# Altium project TP2_ESP8266.PrjPcb
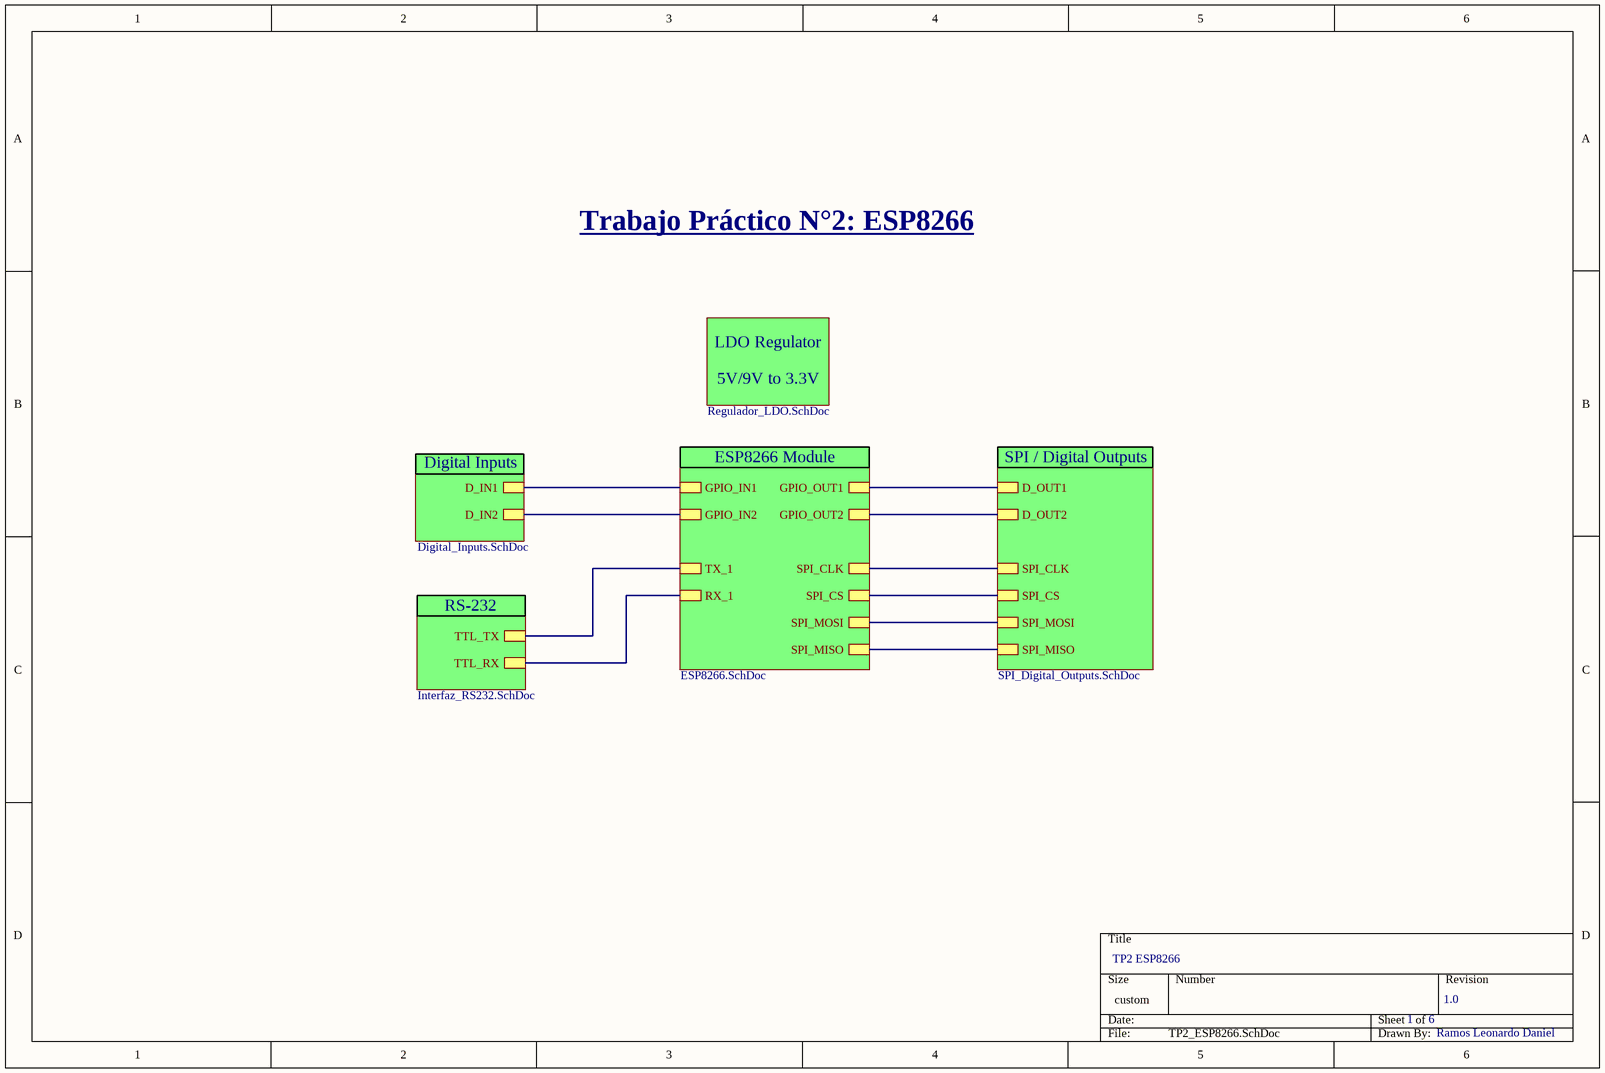
[diagram p0: TP2_ESP8266.SchDoc]
6 sheets, 33 parts. Net scope: hierarchical (ports join the sheet entries above them; power ports are global).
Board file: TP2_ESP8266.PcbDoc
Sheets:
  TP2_ESP8266.SchDoc
    Regulador LDO = Regulador_LDO.SchDoc
    RS-232 = Interfaz_RS232.SchDoc
    Digital Inputs = Digital_Inputs.SchDoc
    SPI/ Digital_Outputs = SPI_Digital_Outputs.SchDoc
    ESP8266 = ESP8266.SchDoc

## Sheet TP2_ESP8266.SchDoc: Leonardo
size 300 x 200 mm; SheetNumber: 1; SheetTotal: 6

### Sub-sheets
Digital Inputs = Digital_Inputs.SchDoc: D_IN1, D_IN2
ESP8266 = ESP8266.SchDoc: TX_1, RX_1, SPI_CLK, SPI_CS, SPI_MISO, SPI_MOSI, GPIO_IN1, GPIO_IN2, GPIO_OUT1, GPIO_OUT2
Regulador LDO = Regulador_LDO.SchDoc: no entries
RS-232 = Interfaz_RS232.SchDoc: TTL_TX, TTL_RX
SPI/ Digital_Outputs = SPI_Digital_Outputs.SchDoc: D_OUT1, D_OUT2, SPI_CLK, SPI_CS, SPI_MOSI, SPI_MISO

### Nets
DIGITAL_IN1: sheet Digital Inputs/D_IN1, sheet ESP8266/GPIO_IN1
DIGITAL_IN2: sheet Digital Inputs/D_IN2, sheet ESP8266/GPIO_IN2
DIGITAL_OUT1: sheet SPI/ Digital_Outputs/D_OUT1, sheet ESP8266/GPIO_OUT1
DIGITAL_OUT2: sheet SPI/ Digital_Outputs/D_OUT2, sheet ESP8266/GPIO_OUT2
RX_1: sheet RS-232/TTL_RX, sheet ESP8266/RX_1
SPI_CLK: sheet SPI/ Digital_Outputs/SPI_CLK, sheet ESP8266/SPI_CLK
SPI_CS: sheet SPI/ Digital_Outputs/SPI_CS, sheet ESP8266/SPI_CS
SPI_MISO: sheet SPI/ Digital_Outputs/SPI_MISO, sheet ESP8266/SPI_MISO
SPI_MOSI: sheet SPI/ Digital_Outputs/SPI_MOSI, sheet ESP8266/SPI_MOSI
TX_1: sheet RS-232/TTL_TX, sheet ESP8266/TX_1

### Notes on the sheet
- Trabajo Práctico N°2: ESP8266
- LDO Regulator
- 5V/9V to 3.3V
- Digital Inputs
- ESP8266 Module
- SPI / Digital Outputs
- RS-232
- TP2 ESP8266
- 1
- 6
- 1.0
- Ramos Leonardo Daniel

## Sheet Regulador_LDO.SchDoc
size A4; SheetNumber: 2; SheetTotal: 6
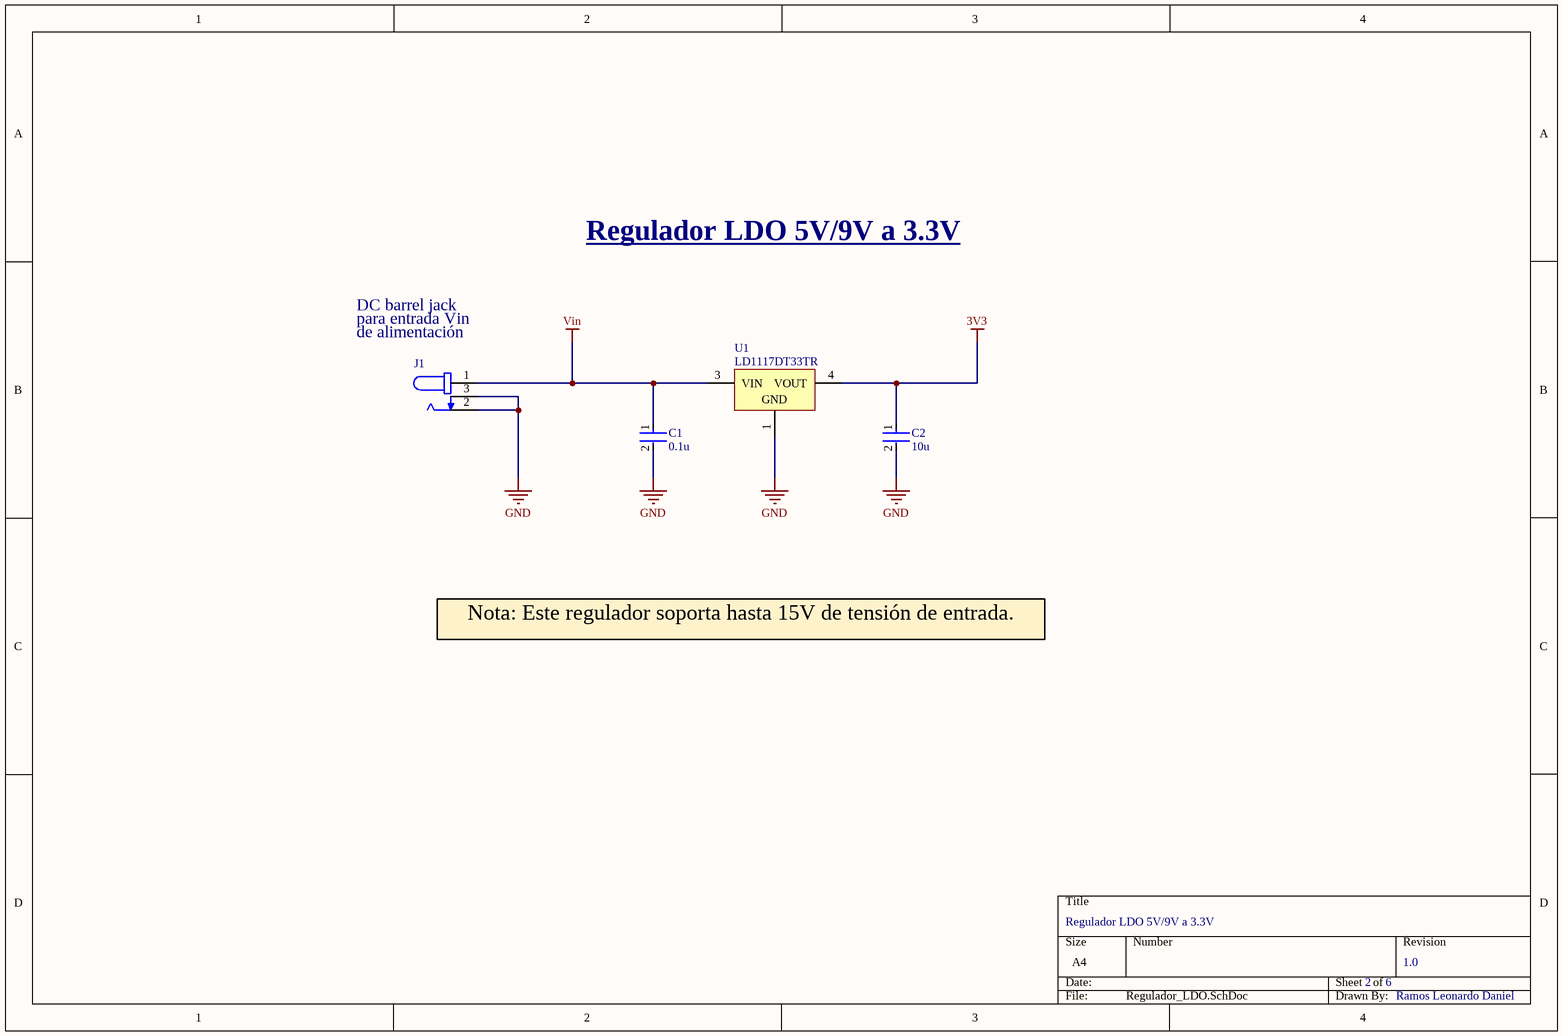
[diagram p1: Regulador_LDO.SchDoc]

### Parts
C1  0.1u  [FP-GRM21B-0_1-IPC_B]
C2  10u  [FP-C0805C106J8RACAUTO-MFG]
J1  DCJ200-10-A-XX-K_REVA  [GCT_DCJ200-10-A-XX-K_REVA]  (value not drawn)
U1  LD1117DT33TR  [TO-252_N]

### Nets
3V3: C2.1 U1.4(VOUT)
GND: C1.2 C2.2 J1.2 J1.3 U1.1(GND)
Vin: C1.1 J1.1 U1.3(VIN)

### Notes on the sheet
- Regulador LDO 5V/9V a 3.3V
- DC barrel jack
- para entrada Vin
- (near J1) de alimentación
- Nota: Este regulador soporta hasta 15V de tensión de entrada.
- 2
- 6
- 1.0
- Ramos Leonardo Daniel

### Library data of the parts
C1 = CMP-06035-037063-1: Chip Multilayer Ceramic Capacitors for General Purpose, 0805, 0.10uF, U2J, -750ppm/°C, 5%, 10V; Capacitance: 100nF; Depth: 1.25mm; Voltage Rating (DC): 10V; Voltage Rating: 10V; Length: 2mm; Max Operating Temperature: 125°C; Thickness: 0.053inch; Dielectric: U2J; Termination: SMD/SMT; Package Quantity: 3000; Packaging: Tape and Reel; Case Code (Metric): 2012; Tolerance: 5%; Case Code (Imperial): 0805; Case/Package: 0805; Mount: Surface Mount; Width: 0.049inch; Height: 1.25mm; Radiation Hardening: No; Min Operating Temperature: -55°C
C2 = CMP-03020-034708-1: CAP CER 10UF 10V X7R 0805; Tolerance: 5%; Mount: Surface Mount; Capacitance: 10uF; Voltage Rating: 10V; Max Operating Temperature: 125°C; Min Operating Temperature: -55°C; Case/Package: 0805; RoHS Compliant: Yes; Packaging: Tape and Reel; Case Code (Imperial): 0805; Case Code (Metric): 2012; Ratings: AEC-Q200
J1 = DCJ200-10-A-XX-K_REVA: Power Barrel Connector Jack 2.05mm ID (0.081), 5.50mm OD (0.217) Through Hole, Right Angle; MF: Global Connector Technology; MP: DCJ200-10-A-K1-K; SnapEDA_Link: https://www.snapeda.com/parts/DCJ200-10-A-K1-K/Global+Connector+Technology/view-part/?ref=snap; Package: None; Value: *; Check_prices: https://www.snapeda.com/parts/DCJ200-10-A-K1-K/Global+Connector+Technology/view-part/?ref=eda
U1 = CMP-0244-00088-1: Fixed Low Drop Positive Voltage Regulator, 3.3V, 3-Pin DPAK, Tape and Reel; ComponentLink1Description: Manufacturer URL; PackageVersion: 2011; PackageReference: TO-252; ComponentLink2Description: Datasheet; ComponentLink1URL: http://www.st.com; DatasheetVersion: 1/11/2011; PackageDescription: 3-Pin Transistor Outline Package 2.28 mm Pitch, 9.7 mm Lead Span (DPAK); ComponentLink2URL: http://www.st.com/internet/com/TECHNICAL_RESOURCES/TECHNICAL_LITERATURE/DATASHEET/CD00000544.pdf

## Sheet Interfaz_RS232.SchDoc
size A4; SheetNumber: 3; SheetTotal: 6
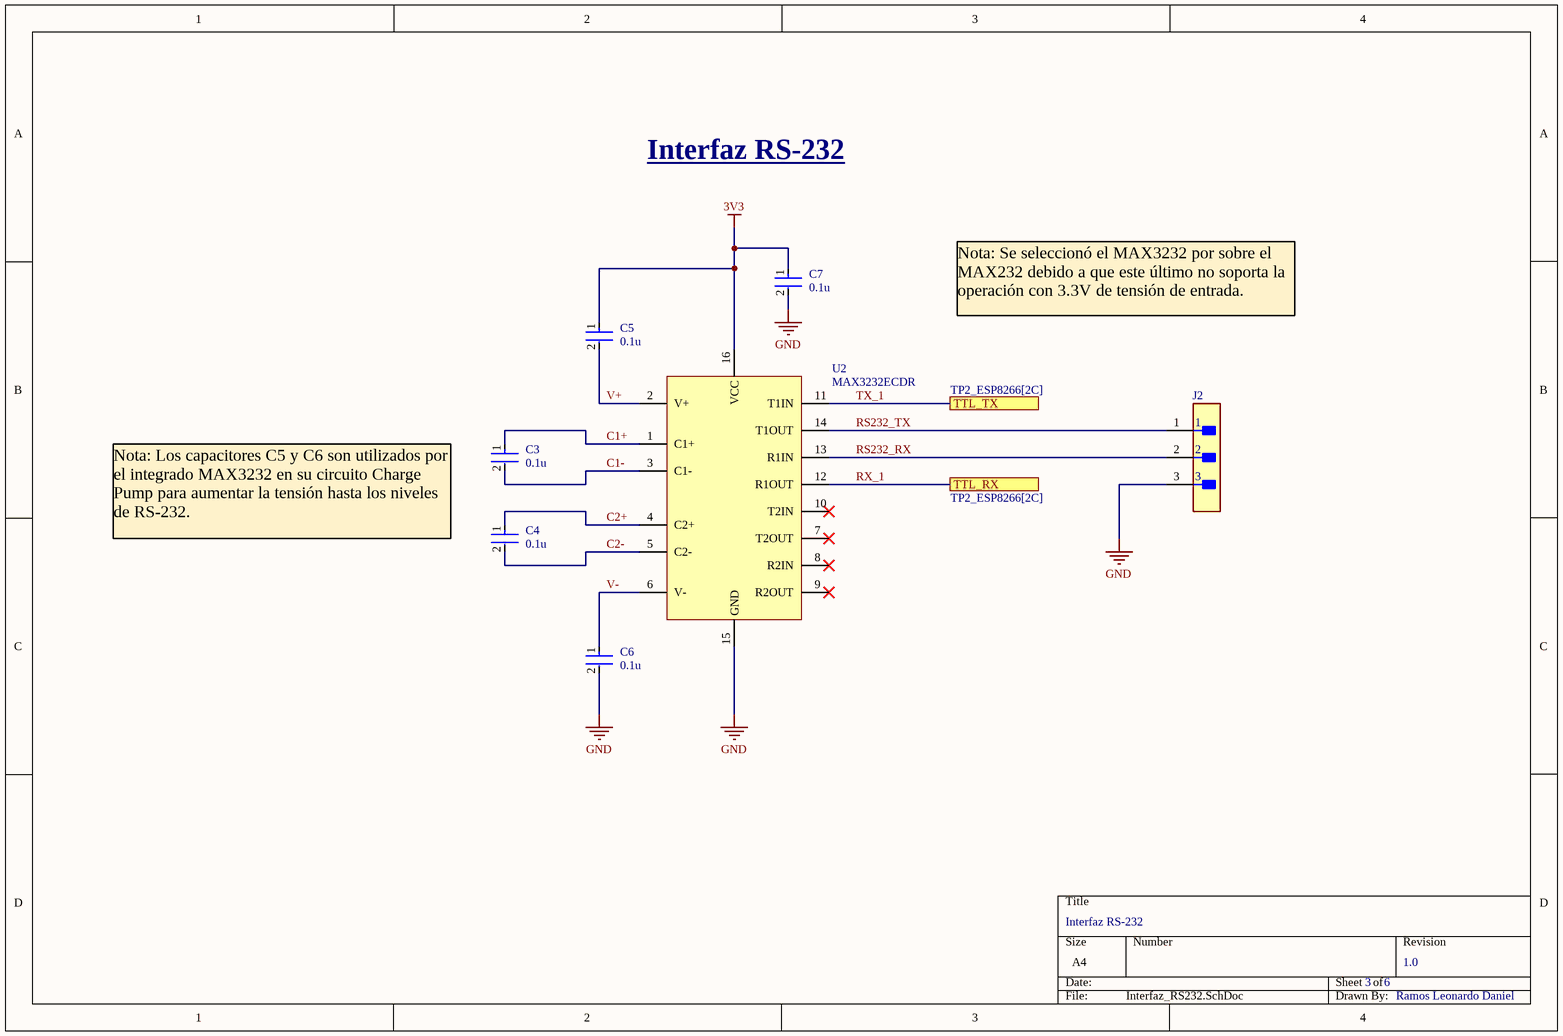
[diagram p2: Interfaz_RS232.SchDoc]

### Parts
C3  value 0.1u  [FP-CC0805-0_85-MFG]  (hidden comment: CC0805KRX7R8BB104)
C4  value 0.1u  [FP-CC0805-0_85-MFG]  (hidden comment: CC0805KRX7R8BB104)
C5  value 0.1u  [FP-CC0805-0_85-MFG]  (hidden comment: CC0805KRX7R8BB104)
C6  value 0.1u  [FP-CC0805-0_85-MFG]  (hidden comment: CC0805KRX7R8BB104)
C7  value 0.1u  [FP-CC0805-0_85-MFG]  (hidden comment: CC0805KRX7R8BB104)
J2  22-11-1031  [FP-0022111031-MFG]  (value not drawn)
U2  MAX3232ECDR  [D0016A_M]

### Ports
TTL_RX (see TP2_ESP8266[2C]), TTL_TX (see TP2_ESP8266[2C])

### Nets
3V3: C5.1 C7.1 U2.16(VCC)
GND: C6.2 C7.2 J2.3 U2.15(GND)
C1+: C3.1 U2.1(C1+)
C1-: C3.2 U2.3(C1-)
C2+: C4.1 U2.4(C2+)
C2-: C4.2 U2.5(C2-)
RS232_RX: J2.2 U2.13(R1IN)
RS232_TX: J2.1 U2.14(T1OUT)
RX_1: U2.12(R1OUT) ; port TTL_RX
TX_1: U2.11(T1IN) ; port TTL_TX
V+: C5.2 U2.2(V+)
V-: C6.1 U2.6(V-)

Not connected (* = marked no-connect by the designer): U2 7(T2OUT)* 8(R2IN)* 9(R2OUT)* 10(T2IN)*

### Notes on the sheet
- Interfaz RS-232
- Nota: Se seleccionó el MAX3232 por sobre el MAX232 debido a que este último no soporta la operación con 3.3V de tensión de entrada.
- Nota: Los capacitores C5 y C6 son utilizados por el integrado MAX3232 en su circuito Charge Pump para aumentar la tensión hasta los niveles de RS-232.
- 3
- 6
- 1.0
- Ramos Leonardo Daniel

### Library data of the parts
C3-C7 = CMP-1036-04410-2: CAP CER 0.1UF 25V X7R 0805; Manufacturer: Yageo; Tolerance: 0.1; Material: Ceramic; Capacitance: 100 nF; ComponentLink2URL: http://www.yageo.com/documents/recent/UPY-GPHC_Y5V_6.3V-to-50V_8.pdf; Category: Cap; Mouser Description: Multilayer Ceramic Capacitors MLCC - SMD/SMT 100nF 25V X7R 10%; Manufacturer Part Number: CC0805KRX7R8BB104; Device Class L1: Passive Components; Footprint Url: http://www.yageo.com/exep/pages/download/literatures/UPY-C_GEN_24.pdf; Height: 0.95mm; Digikey Description: CAP CER 0.1UF 25V X7R 0805; Lead Free: Yes; Temperature Range High: +85°C; Temperature: -30°C to +85°C; Ipc Land Pattern Name: CAPC200125X85; Automotive: No; Octopart: https://octopart.com/cc0805krx7r8bb104-yageo-39467766; Device Class L2: Capacitors; Temperature Characteristic: X7R; Voltage Rating: 25 V; ComponentLink2Description: Datasheet; Temperature Range Low: -30°C; Device Class L3: Ceramic Capacitors; RoHS: TRUE; Package: CC0805-0.85
J2 = CMP-00257-00247512-1: 22-11-1031 Mini-Latch™ Wire-to-Board Header, Vertical, with Friction Ramp, 3 Circuits, Gold (Au) Plating; Manufacturer Lifecycle Status: ACTIVE; NexarPartId: 247512; Number of Positions: 3; Current Rating: 3A; Gender: Male; Pitch: 2.5mm; Connector Type: Male Pin; Contact Resistance: 20mΩ; Voltage Rating: 250V; Max Voltage Rating (DC): 250.25kV; Color: Natural; Fastening Type: Friction; RoHS: Compliant; Contact Mating Length: 7.493mm; Lifecycle Status: Production; Number of Rows: 1; Schedule B: 8536694040, 8536694040; Radiation Hardening: No; Number of Contacts: 3; Depth: 4.9mm; Termination: Solder; Housing Color: Natural; Max Operating Temperature: 105°C; Mount: Through Hole; Height: 12.1mm; Lead Free: Lead Free; Contact Gender: Male; Plating: Gold; Contact Material: Brass; Length: 7mm; Country of Origin: KR; Housing Material: Nylon; Number of Circuits: 3; Contact Plating: Gold; Packaging: Bulk; Orientation: Vertical; Min Operating Temperature: -40°C; REACH SVHC: Unknown

## Sheet Digital_Inputs.SchDoc
size A4; SheetNumber: 4; SheetTotal: 6
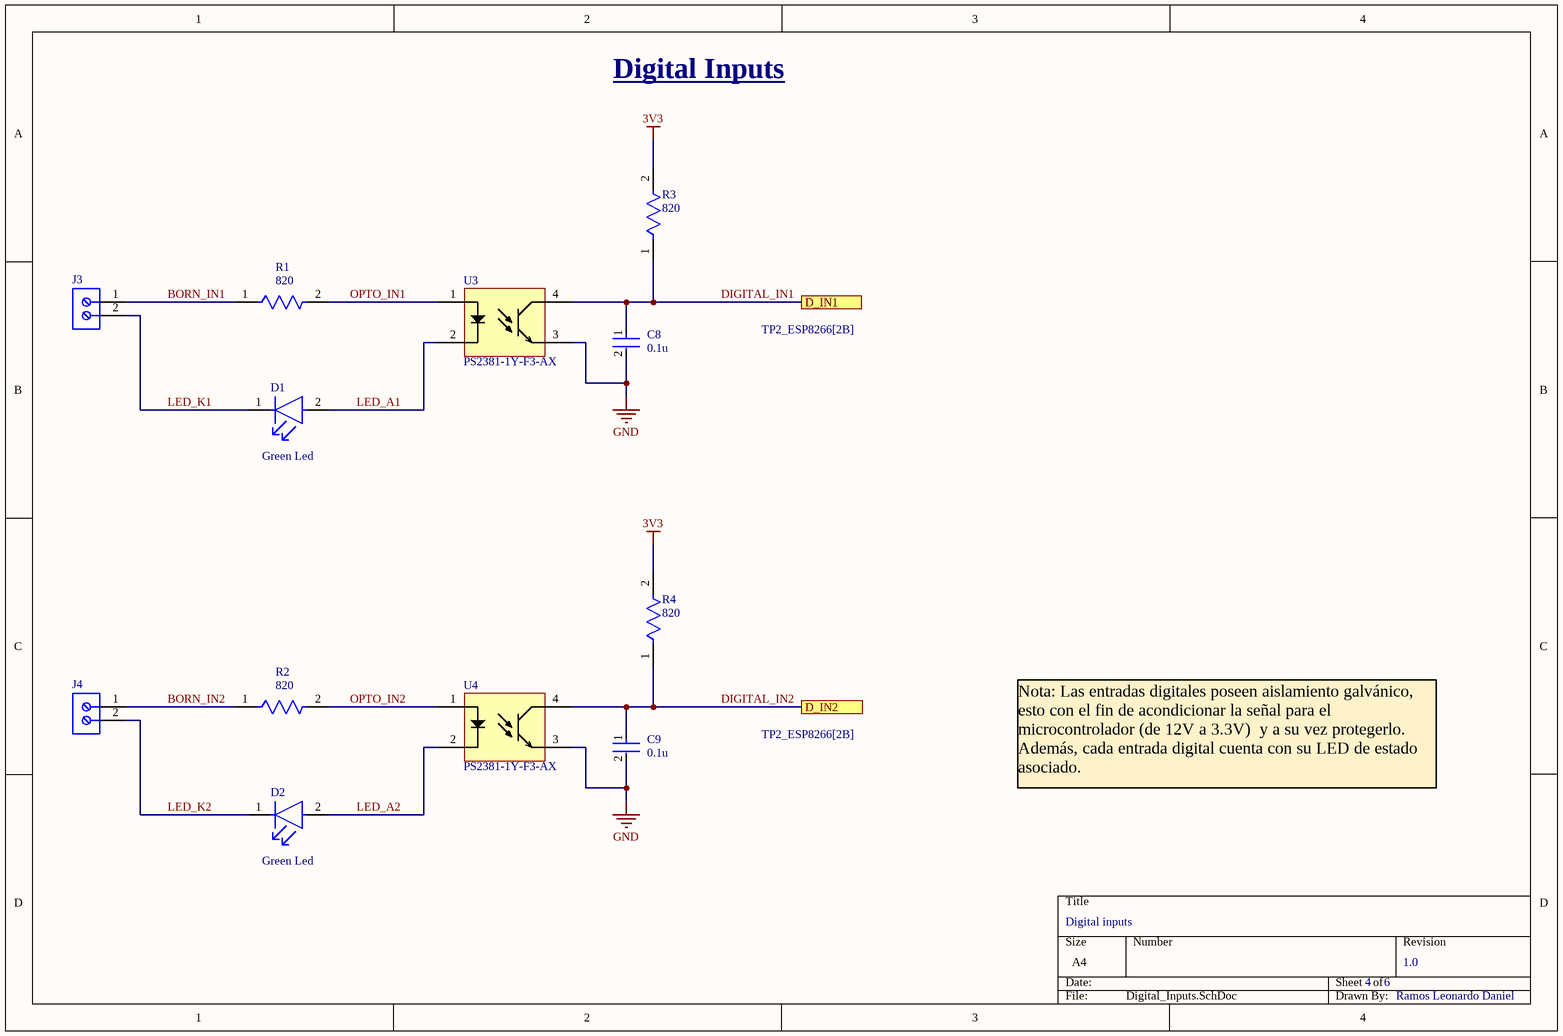
[diagram p3: Digital_Inputs.SchDoc]

### Parts
C8  value 0.1u  [FP-CC0805-0_85-MFG]  (hidden comment: CC0805KRX7R8BB104)
C9  value 0.1u  [FP-CC0805-0_85-MFG]  (hidden comment: CC0805KRX7R8BB104)
D1  Green Led  [FP-LTST-C190GKT-MFG]
D2  Green Led  [FP-LTST-C190GKT-MFG]
J3  691137710002  [691137710002]  (value not drawn)
J4  691137710002  [691137710002]  (value not drawn)
R1  Resistance: 820  [FP-CRCW0805-e3-IPC_B]  (hidden comment: CRCW08054K70JNEA)
R2  Resistance: 820  [FP-CRCW0805-e3-IPC_B]  (hidden comment: CRCW08054K70JNEA)
R3  Resistance: 820  [FP-CRCW0805-e3-IPC_B]  (hidden comment: CRCW08054K70JNEA)
R4  Resistance: 820  [FP-CRCW0805-e3-IPC_B]  (hidden comment: CRCW08054K70JNEA)
U3  PS2381-1Y-F3-AX  [LSOP254P1020X230-4N]
U4  PS2381-1Y-F3-AX  [LSOP254P1020X230-4N]

### Ports
D_IN1 (see TP2_ESP8266[2B]), D_IN2 (see TP2_ESP8266[2B])

### Nets
3V3: R3.2 R4.2
GND: C8.2 C9.2 U3.3(Emitter) U4.3(Emitter)
BORN_IN1: J3.1 R1.1
BORN_IN2: J4.1 R2.1
DIGITAL_IN1: C8.1 R3.1 U3.4(Collector) ; port D_IN1
DIGITAL_IN2: C9.1 R4.1 U4.4(Collector) ; port D_IN2
LED_A1: D1.2(A) U3.2(Cathode)
LED_A2: D2.2(A) U4.2(Cathode)
LED_K1: D1.1(C) J3.2
LED_K2: D2.1(C) J4.2
OPTO_IN1: R1.2 U3.1(Anode)
OPTO_IN2: R2.2 U4.1(Anode)

### Notes on the sheet
- Digital Inputs
- Nota: Las entradas digitales poseen aislamiento galvánico, esto con el fin de acondicionar la señal para el microcontrolador (de 12V a 3.3V)  y a su vez protegerlo. Además, cada entrada digital cuenta con su LED de estado asociado.
- Digital inputs
- 4
- 6
- 1.0
- Ramos Leonardo Daniel

### Library data of the parts
C8 C9 = CMP-1036-04410-2: as C3 on sheet Interfaz_RS232; ComponentLink2URL: http://www.yageo.com/documents/recent/UPY-GPHC_Y5V_6.3V-to-50V_8.pdf; Category: Cap; Mouser Description: Multilayer Ceramic Capacitors MLCC - SMD/SMT 100nF 25V X7R 10%; Manufacturer Part Number: CC0805KRX7R8BB104; Device Class L1: Passive Components; Footprint Url: http://www.yageo.com/exep/pages/download/literatures/UPY-C_GEN_24.pdf; Height: 0.95mm; Digikey Description: CAP CER 0.1UF 25V X7R 0805; Lead Free: Yes; Temperature Range High: +85°C; Temperature: -30°C to +85°C; Ipc Land Pattern Name: CAPC200125X85; Automotive: No; Octopart: https://octopart.com/cc0805krx7r8bb104-yageo-39467766; Device Class L2: Capacitors; Temperature Characteristic: X7R; Voltage Rating: 25 V; ComponentLink2Description: Datasheet; Temperature Range Low: -30°C; Device Class L3: Ceramic Capacitors; RoHS: TRUE; Package: CC0805-0.85
D1 D2 = CMP-22017-000005-2: LED GREEN CLEAR CHIP SMD LTST-C190GKT; Dominant Wavelength: 569nm; Reverse Voltage: 5V; Lens Color: Colorless; Viewing Angle: 130°; Voltage: 2V; Forward Current: 30mA; Power Dissipation: 100mW; Luminous Intensity: 6mcd; Number of LEDs: 1; Forward Voltage: 2.1V; Wavelength: 565nm; Test Current: 10mA; Min Operating Temperature: -55°C; Lens Style: Clear; Mount: Surface Mount; Width: 0.8mm; Packaging: Tape and Reel; Lens Transparency: Clear; Case Code (Metric): 1608; Depth: 0.8mm; Case Code (Imperial): 0603; Case/Package: 0603; Number of Pins: 2; Max Operating Temperature: 85°C; Lead Free: Lead Free; Number of Elements: 1; Length: 1.6mm; Height: 0.8mm; Package Quantity: 1; Power Rating: 100mW; Radiation Hardening: No; Illumination Color: Green; Color: Green
J3 J4 = CMP-1502-03324-2: NexarPartId: 78871135; Voltage Rating: 300V; Number of Contacts: 2; Current Rating: 16A; Lead Pitch: 5mm; Height: 11.6mm; Packaging: Box; RoHS: Non-Compliant; Contact Material: Nickel, Tin; Max Operating Temperature: 120°C; Number of Pins: 2; Min Operating Temperature: -30°C; Number of Rows: 1
R1-R4 = CMP-2001-03967-2: RES Thick Film, 4.7kΩ, 5%, 0.125W, 200ppm/°C, 0805; Power Rating: 125mW; Voltage Rating: 150V; Radiation Hardening: No; Case Code (Imperial): 0805; Military Standard: Not; Contact Plating: Tin; Weight: 0.000194oz; Mount: Surface Mount; Termination: SMD/SMT; Packaging: Tape and Reel; Min Operating Temperature: -55°C; Width: 1.25mm; Tolerance: 5%; Height: 0.45mm; Depth: 1.25mm; Length: 2mm; Temperature Coefficient: 200ppm/°C; Case Code (Metric): 2012; Package Quantity: 5000; Max Operating Temperature: 155°C; Case/Package: 0805; Composition: Thick Film
U3 U4 = CMP-00572-25656563-1: PS2381-1Y-F3-AX Optocoupler, Transistor, 5Kv, Lsop-4 Rohs Compliant: Yes; Forward Current: 60mA; Reverse Breakdown Voltage: 6V; Collector Emitter Saturation Voltage: 300mV; Forward Voltage: 1.4V; Current Transfer Ratio: 400%; Number of Elements: 1; Collector Emitter Voltage (VCEO): 80V; Power Dissipation: 250mW; Max Operating Temperature: 115°C; Number of Pins: 4; Mount: Surface Mount; NexarPartId: 25656563; Case/Package: SOP; Min Operating Temperature: -40°C; RoHS: Compliant; Packaging: Tape and Reel

## Sheet SPI_Digital_Outputs.SchDoc
size A4; SheetNumber: 5; SheetTotal: 6
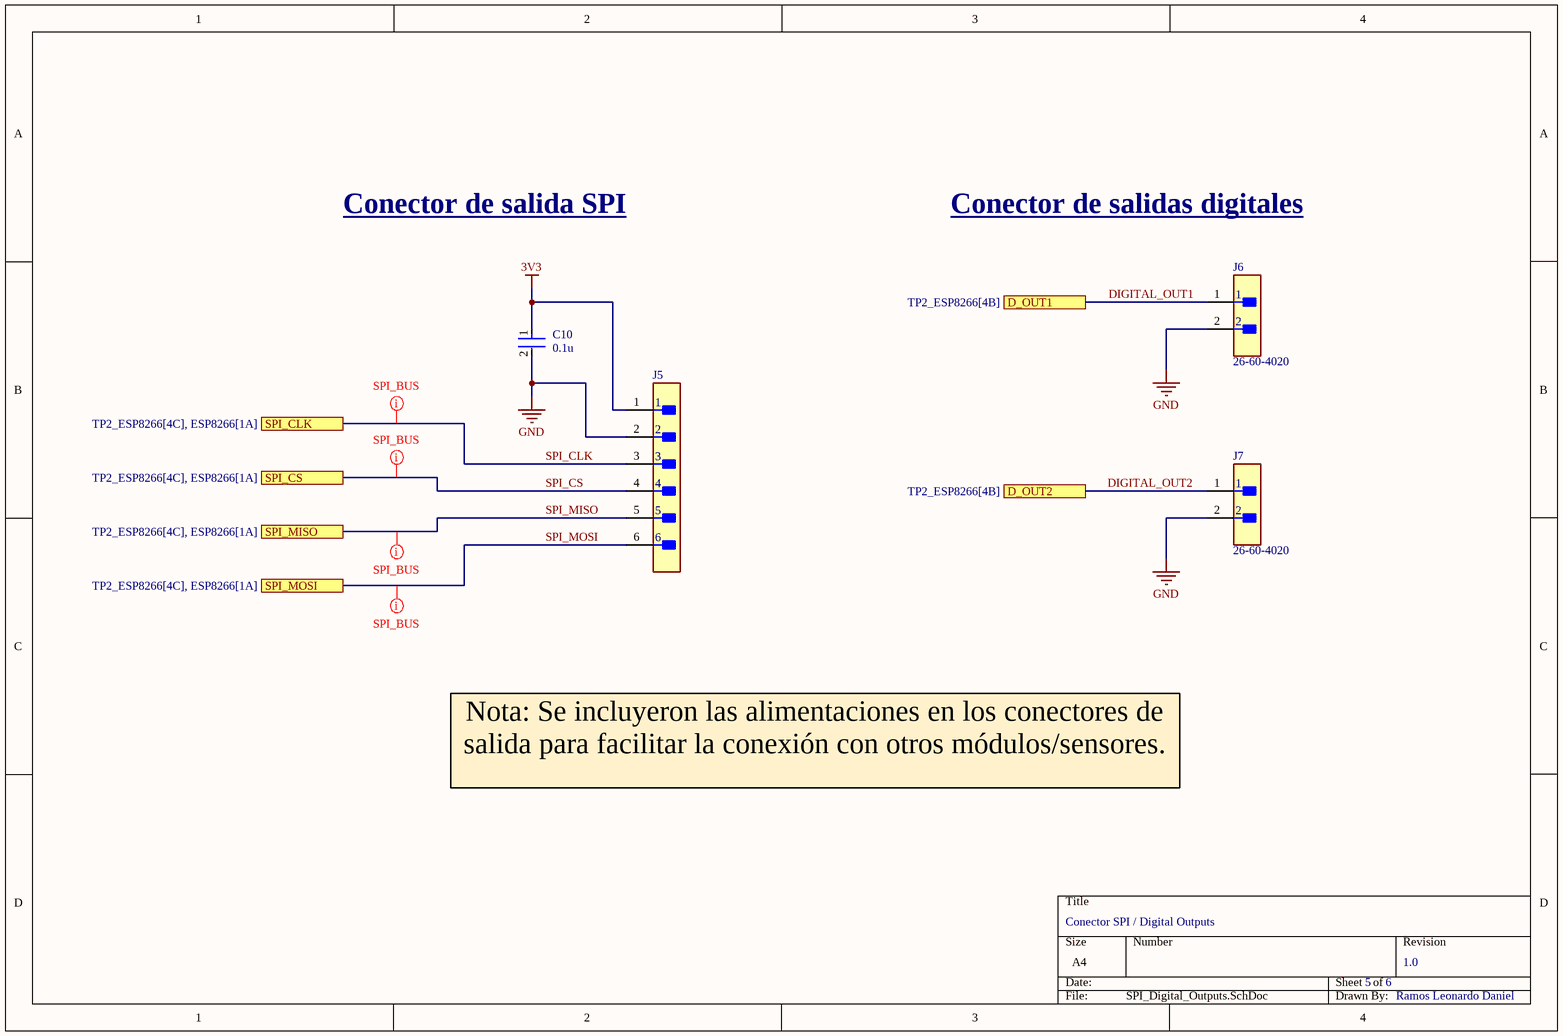
[diagram p4: SPI_Digital_Outputs.SchDoc]

### Parts
C10  value 0.1u  [FP-CC0805-0_85-MFG]  (hidden comment: CC0805KRX7R8BB104)
J5  22-27-2061  [FP-22-27-2061-MFG]  (value not drawn)
J6  26-60-4020  [FP-26-60-4020-MFG]
J7  26-60-4020  [FP-26-60-4020-MFG]

### Ports
D_OUT1 (see TP2_ESP8266[4B]), D_OUT2 (see TP2_ESP8266[4B]), SPI_CLK (see TP2_ESP8266[4C], ESP8266[1A]), SPI_CS (see TP2_ESP8266[4C], ESP8266[1A]), SPI_MISO (see TP2_ESP8266[4C], ESP8266[1A]), SPI_MOSI (see TP2_ESP8266[4C], ESP8266[1A])

### Nets
3V3: C10.1 J5.1
GND: C10.2 J5.2 J6.2 J7.2
DIGITAL_OUT1: J6.1 ; port D_OUT1
DIGITAL_OUT2: J7.1 ; port D_OUT2
SPI_CLK: J5.3 ; port SPI_CLK
SPI_CS: J5.4 ; port SPI_CS
SPI_MISO: J5.5 ; port SPI_MISO
SPI_MOSI: J5.6 ; port SPI_MOSI

### Layout directives
net class SPI_BUS: SPI_CLK, SPI_CS, SPI_MISO, SPI_MOSI

### Notes on the sheet
- Conector de salida SPI
- Conector de salidas digitales
- Nota: Se incluyeron las alimentaciones en los conectores de salida para facilitar la conexión con otros módulos/sensores.
- Conector SPI / Digital Outputs
- 5
- 6
- 1.0
- Ramos Leonardo Daniel

### Library data of the parts
C10 = CMP-1036-04410-2: as C3 on sheet Interfaz_RS232; ComponentLink2URL: http://www.yageo.com/documents/recent/UPY-GPHC_Y5V_6.3V-to-50V_8.pdf; Category: Cap; Mouser Description: Multilayer Ceramic Capacitors MLCC - SMD/SMT 100nF 25V X7R 10%; Manufacturer Part Number: CC0805KRX7R8BB104; Device Class L1: Passive Components; Footprint Url: http://www.yageo.com/exep/pages/download/literatures/UPY-C_GEN_24.pdf; Height: 0.95mm; Digikey Description: CAP CER 0.1UF 25V X7R 0805; Lead Free: Yes; Temperature Range High: +85°C; Temperature: -30°C to +85°C; Ipc Land Pattern Name: CAPC200125X85; Automotive: No; Octopart: https://octopart.com/cc0805krx7r8bb104-yageo-39467766; Device Class L2: Capacitors; Temperature Characteristic: X7R; Voltage Rating: 25 V; ComponentLink2Description: Datasheet; Temperature Range Low: -30°C; Device Class L3: Ceramic Capacitors; RoHS: TRUE; Package: CC0805-0.85
J5 = CMP-04776-000309-1: CONN HEADER VERT 6POS 2.54MM; Number of Contacts: 6; Current Rating: 4A; Voltage Rating (AC): 250V; Contact Resistance: 10mR; Hole Diameter: 1.02mm; Connector Type: Male Pin; Gender: Male; Mount: Through Hole; REACH SVHC: No SVHC; Number of Rows: 1; Contact Plating: Tin; Series: KK; Depth: 5.8mm; Flammability Rating: UL94 V-0; Contact Type: Male Pin; Lead Pitch: 2.54mm; Min Operating Temperature: 0°C; Pitch: 2.54mm; Radiation Hardening: No; Color: Natural; Length: 15.24mm; Termination: Solder; Orientation: Straight; Contact Material: Brass; Max Voltage Rating (AC): 250V; Housing Material: Nylon; Max Operating Temperature: 75°C; Working Voltage: 250V; Max Current Rating: 4A; Fastening Type: Friction; Voltage Rating: 250V; Housing Color: White; Packaging: Bulk; Material: Nylon; Contact Mating Length: 0.295inch; Package Quantity: 10000; Number of Positions: 6
J6 J7 = CMP-04776-000303-1: CONN HEADER VERT 2POS 3.96MM; Number of Contacts: 2; Contact Resistance: 6mR; Current Rating: 7A; Gender: Male; Voltage Rating: 250V; Number of Lines: 1; Approvals: UL; Glow Wire Compliant: Non-compliant; Depth: 10.01mm; Color: Natural; Mount: Through Hole; Flammability Rating: UL94 V-0; Max Operating Temperature: 75°C; Termination: Solder; Lead Free: Lead Free; Length: 7.77mm; Height: 14.73mm; Min Operating Temperature: 0°C; Contact Gender: Male; Housing Material: Polyester; Number of Rows: 1; Material: Polyester; Fastening Type: Friction; Contact Material: Brass; Radiation Hardening: No; Pitch: 3.96mm; Number of Circuits: 2; Contact Plating: Tin; Packaging: Bulk; Housing Color: Natural; Contact Mating Length: 0.45inch; Contact Type: Male Pin; Number of Positions: 2; Orientation: Straight; Package Quantity: 1400; Series: KK® 41791; Max Voltage Rating (AC): 250V; RoHS Compliant: Yes; Max Current Rating: 7A; Number of Poles: 2

## Sheet ESP8266.SchDoc
size A4; SheetNumber: 6; SheetTotal: 6
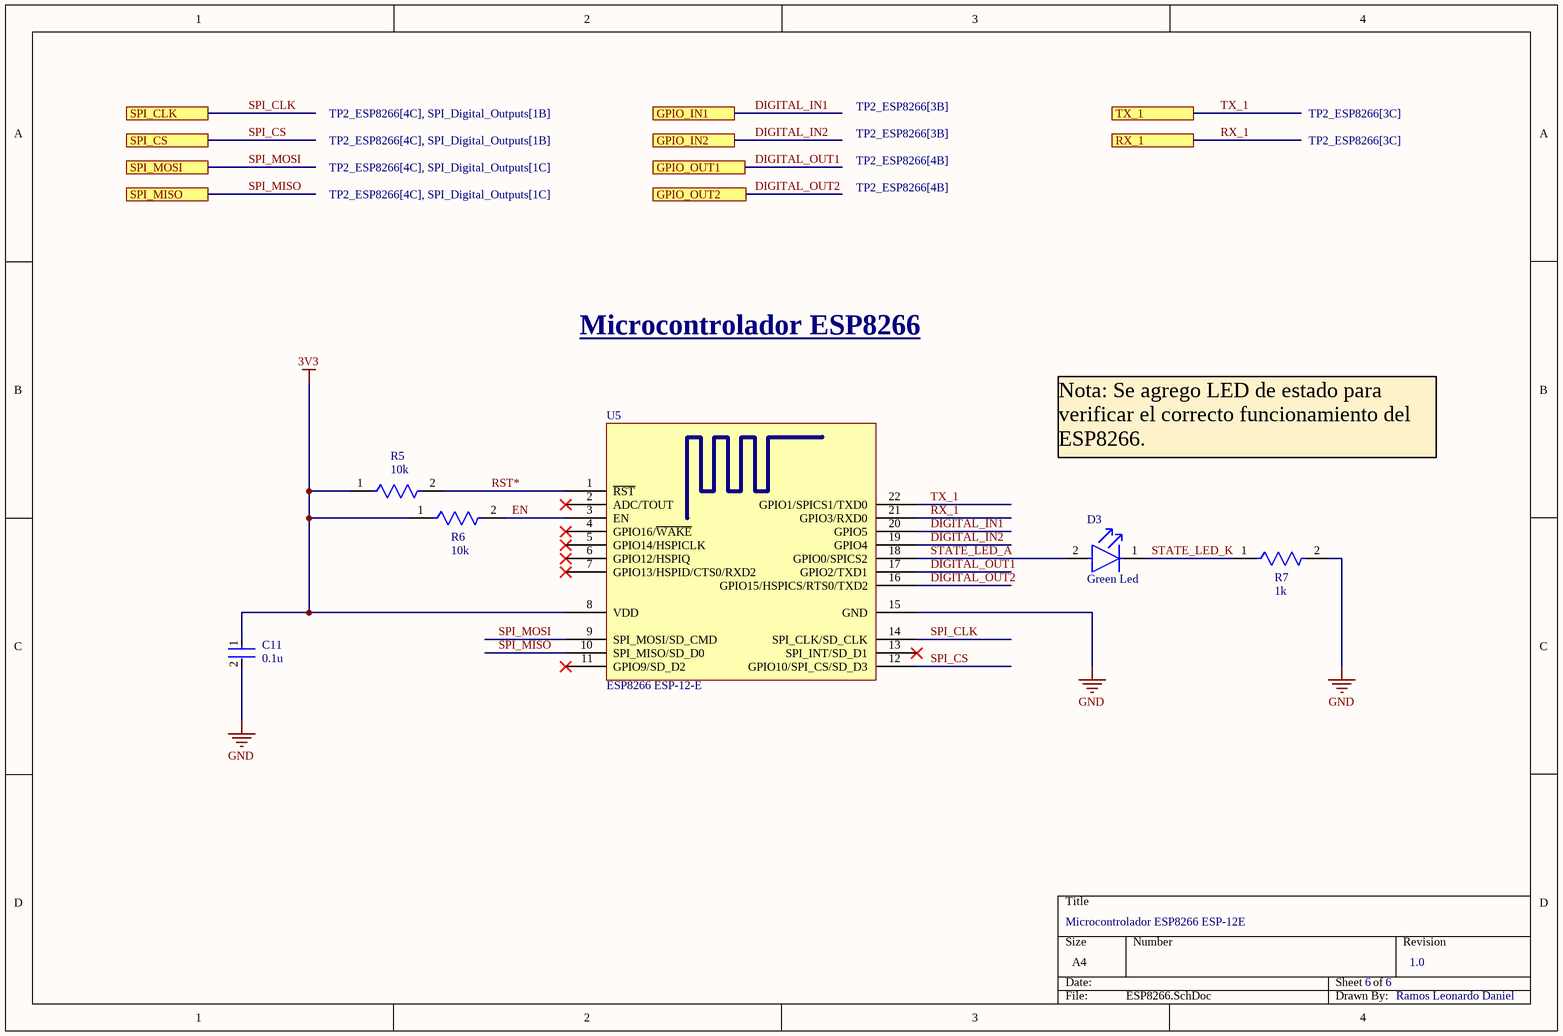
[diagram p5: ESP8266.SchDoc]

### Parts
C11  value 0.1u  [FP-CC0805-0_85-MFG]  (hidden comment: CC0805KRX7R8BB104)
D3  Green Led  [FP-LTST-C190GKT-MFG]
R5  Resistance: 10k  [FP-CRCW0805-e3-IPC_B]  (hidden comment: CRCW08054K70JNEA)
R6  Resistance: 10k  [FP-CRCW0805-e3-IPC_B]  (hidden comment: CRCW08054K70JNEA)
R7  Resistance: 1k  [FP-CRCW0805-e3-IPC_B]  (hidden comment: CRCW08054K70JNEA)
U5  ESP8266 ESP-12-E  [ESP8266 ESP-12-E]

### Ports
GPIO_IN1 (see TP2_ESP8266[3B]), GPIO_IN2 (see TP2_ESP8266[3B]), GPIO_OUT1 (see TP2_ESP8266[4B]), GPIO_OUT2 (see TP2_ESP8266[4B]), RX_1 (see TP2_ESP8266[3C]), SPI_CLK (see TP2_ESP8266[4C], SPI_Digital_Outputs[1B]), SPI_CS (see TP2_ESP8266[4C], SPI_Digital_Outputs[1B]), SPI_MISO (see TP2_ESP8266[4C], SPI_Digital_Outputs[1C]), SPI_MOSI (see TP2_ESP8266[4C], SPI_Digital_Outputs[1C]), TX_1 (see TP2_ESP8266[3C])

### Nets
3V3: C11.1 R5.1 R6.1 U5.8(VDD)
GND: C11.2 R7.2 U5.15(GND)
DIGITAL_IN1: U5.20(GPIO5) ; port GPIO_IN1
DIGITAL_IN2: U5.19(GPIO4) ; port GPIO_IN2
DIGITAL_OUT1: U5.17(GPIO2/TXD1) ; port GPIO_OUT1
DIGITAL_OUT2: U5.16(GPIO15/HSPICS/RTS0/TXD2) ; port GPIO_OUT2
EN: R6.2 U5.3(EN)
RST*: R5.2 U5.1(~{RST})
RX_1: U5.21(GPIO3/RXD0) ; port RX_1
SPI_CLK: U5.14(SPI_CLK/SD_CLK) ; port SPI_CLK
SPI_CS: U5.12(GPIO10/SPI_CS/SD_D3) ; port SPI_CS
SPI_MISO: U5.10(SPI_MISO/SD_D0) ; port SPI_MISO
SPI_MOSI: U5.9(SPI_MOSI/SD_CMD) ; port SPI_MOSI
STATE_LED_A: D3.2(A) U5.18(GPIO0/SPICS2)
STATE_LED_K: D3.1(C) R7.1
TX_1: U5.22(GPIO1/SPICS1/TXD0) ; port TX_1

Not connected (* = marked no-connect by the designer): U5 2(ADC/TOUT)* 4(GPIO16/~{WAKE})* 5(GPIO14/HSPICLK)* 6(GPIO12/HSPIQ)* 7(GPIO13/HSPID/CTS0/RXD2)* 11(GPIO9/SD_D2)* 13(SPI_INT/SD_D1)*

### Notes on the sheet
- Microcontrolador ESP8266
- Nota: Se agrego LED de estado para verificar el correcto funcionamiento del ESP8266.
- Microcontrolador ESP8266 ESP-12E
- 6
- 1.0
- Ramos Leonardo Daniel

### Library data of the parts
C11 = CMP-1036-04410-2: as C3 on sheet Interfaz_RS232; ComponentLink2URL: http://www.yageo.com/documents/recent/UPY-GPHC_Y5V_6.3V-to-50V_8.pdf; Category: Cap; Mouser Description: Multilayer Ceramic Capacitors MLCC - SMD/SMT 100nF 25V X7R 10%; Manufacturer Part Number: CC0805KRX7R8BB104; Device Class L1: Passive Components; Footprint Url: http://www.yageo.com/exep/pages/download/literatures/UPY-C_GEN_24.pdf; Height: 0.95mm; Digikey Description: CAP CER 0.1UF 25V X7R 0805; Lead Free: Yes; Temperature Range High: +85°C; Temperature: -30°C to +85°C; Ipc Land Pattern Name: CAPC200125X85; Automotive: No; Octopart: https://octopart.com/cc0805krx7r8bb104-yageo-39467766; Device Class L2: Capacitors; Temperature Characteristic: X7R; Voltage Rating: 25 V; ComponentLink2Description: Datasheet; Temperature Range Low: -30°C; Device Class L3: Ceramic Capacitors; RoHS: TRUE; Package: CC0805-0.85
D3 = CMP-22017-000005-2: as D1 on sheet Digital_Inputs; Min Operating Temperature: -55°C; Lens Style: Clear; Mount: Surface Mount; Width: 0.8mm; Packaging: Tape and Reel; Lens Transparency: Clear; Case Code (Metric): 1608; Depth: 0.8mm; Case Code (Imperial): 0603; Case/Package: 0603; Number of Pins: 2; Max Operating Temperature: 85°C; Lead Free: Lead Free; Number of Elements: 1; Length: 1.6mm; Height: 0.8mm; Package Quantity: 1; Power Rating: 100mW; Radiation Hardening: No; Illumination Color: Green; Color: Green
R5-R7 = CMP-2001-03967-2: as R1 on sheet Digital_Inputs; Radiation Hardening: No; Case Code (Imperial): 0805; Military Standard: Not; Contact Plating: Tin; Weight: 0.000194oz; Mount: Surface Mount; Termination: SMD/SMT; Packaging: Tape and Reel; Min Operating Temperature: -55°C; Width: 1.25mm; Tolerance: 5%; Height: 0.45mm; Depth: 1.25mm; Length: 2mm; Temperature Coefficient: 200ppm/°C; Case Code (Metric): 2012; Package Quantity: 5000; Max Operating Temperature: 155°C; Case/Package: 0805; Composition: Thick Film

## Nets that join several sheets
3V3: Regulador_LDO (C2.1 U1.4), Interfaz_RS232 (C5.1 C7.1 U2.16), Digital_Inputs (R3.2 R4.2), SPI_Digital_Outputs (C10.1 J5.1), ESP8266 (C11.1 R5.1 R6.1 U5.8)
GND: Regulador_LDO (5 pins), Interfaz_RS232 (C6.2 C7.2 J2.3 U2.15), Digital_Inputs (C8.2 C9.2 U3.3 U4.3), SPI_Digital_Outputs (C10.2 J5.2 J6.2 J7.2), ESP8266 (C11.2 R7.2 U5.15)
DIGITAL_IN1: Digital_Inputs (C8.1 R3.1 U3.4), ESP8266 (U5.20)
DIGITAL_IN2: Digital_Inputs (C9.1 R4.1 U4.4), ESP8266 (U5.19)
DIGITAL_OUT1: SPI_Digital_Outputs (J6.1), ESP8266 (U5.17)
DIGITAL_OUT2: SPI_Digital_Outputs (J7.1), ESP8266 (U5.16)
RX_1: Interfaz_RS232 (U2.12), ESP8266 (U5.21)
SPI_CLK: SPI_Digital_Outputs (J5.3), ESP8266 (U5.14)
SPI_CS: SPI_Digital_Outputs (J5.4), ESP8266 (U5.12)
SPI_MISO: SPI_Digital_Outputs (J5.5), ESP8266 (U5.10)
SPI_MOSI: SPI_Digital_Outputs (J5.6), ESP8266 (U5.9)
TX_1: Interfaz_RS232 (U2.11), ESP8266 (U5.22)